# EAGLE design SLIM-MO-64 (EAGLE 6.1)
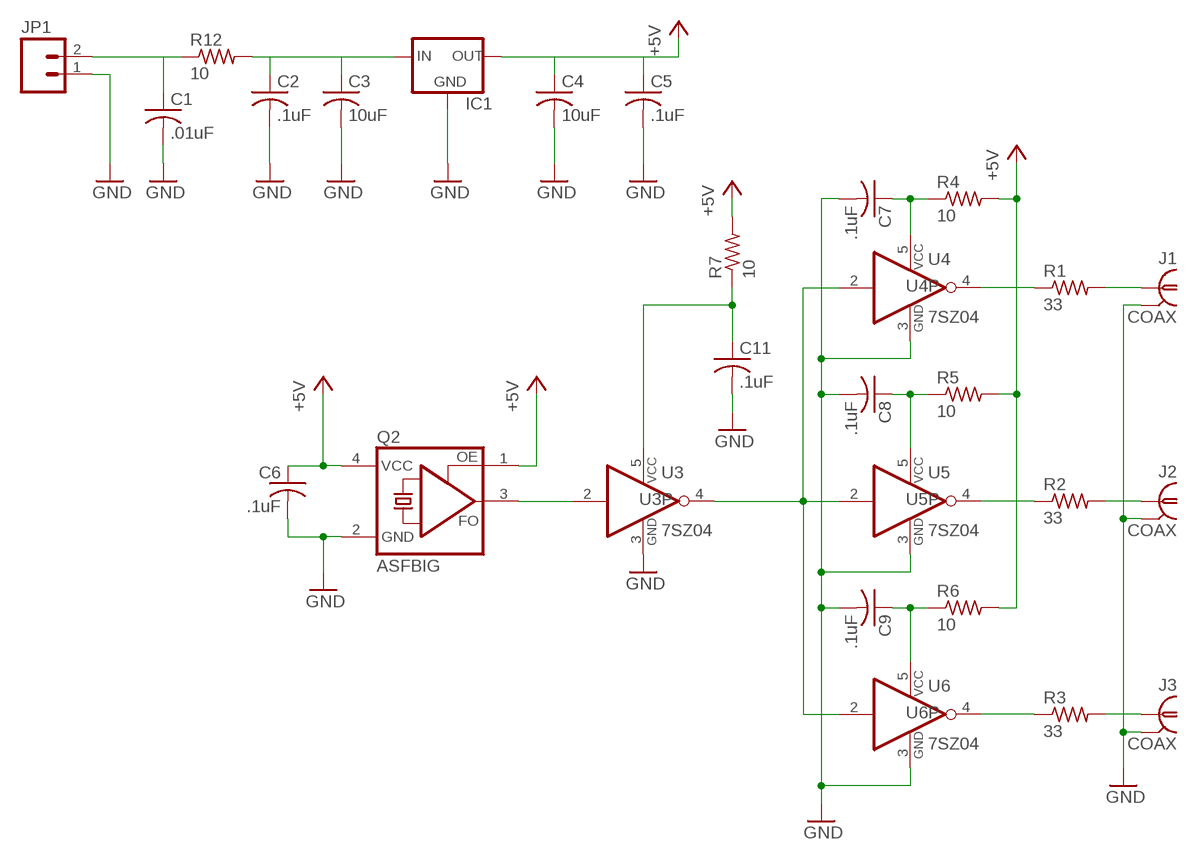
[diagram p0: schematic, sheet 1]

## Parts
C1  .01uF  C-USC0805  [C0805]
C2  .1uF  C-USC0805  [C0805]
C3  10uF  C-USC1206  [C1206]
C4  10uF  C-USC1206  [C1206]
C5  .1uF  C-USC0805  [C0805]
C6  .1uF  C-USC0805  [C0805]
C7  .1uF  C-USC0805  [C0805]
C8  .1uF  C-USC0805  [C0805]
C9  .1uF  C-USC0805  [C0805]
C11  .1uF  C-USC0805  [C0805]
IC1  78MXXLDPAK  [TO252]
J1  COAX  [SLIM_COAX_PAD]
J2  COAX  [SLIM_COAX_PAD]
J3  COAX  [SLIM_COAX_PAD]
JP1  M02POLAR  [MOLEX-1X2]
Q2  ASFBIG  [CTS507]
R1  33  R-US_R0805  [R0805]
R2  33  R-US_R0805  [R0805]
R3  33  R-US_R0805  [R0805]
R4  10  R-US_R0805  [R0805]
R5  10  R-US_R0805  [R0805]
R6  10  R-US_R0805  [R0805]
R7  10  R-US_R0805  [R0805]
R12  10  R-US_R0805  [R0805]
U3  7SZ04  74AHC1G04DBV  [SOT23-5]
U4  7SZ04  74AHC1G04DBV  [SOT23-5]
U5  7SZ04  74AHC1G04DBV  [SOT23-5]
U6  7SZ04  74AHC1G04DBV  [SOT23-5]

## Nets
+5V: C4.1 C5.1 C6.1 IC1.2(OUT) Q2.1(OE) Q2.4(VCC) R4.2 R5.2 R6.2 R7.2
GND: C1.2 C2.2 C3.2 C4.2 C5.2 C6.2 C7.2 C8.2 C9.2 C11.2 IC1.3(GND) J1.P$2(GND) J2.P$2(GND) J3.P$2(GND) JP1.1 Q2.2(GND) U3.3(GND) U4.3(GND) U5.3(GND) U6.3(GND)
N$1: C2.1 C3.1 IC1.1(IN) R12.2
N$2: C1.1 JP1.2 R12.1
N$3: C11.1 R7.1 U3.5(VCC)
N$4: U3.4(O) U4.2(I) U5.2(I) U6.2(I)
N$8: R1.1 U4.4(O)
N$9: R2.1 U5.4(O)
N$10: Q2.3(FO) U3.2(I)
N$11: R3.1 U6.4(O)
N$12: C9.1 R6.1 U6.5(VCC)
N$13: C8.1 R5.1 U5.5(VCC)
N$16: C7.1 R4.1 U4.5(VCC)
N$17: J1.P$1 R1.2
N$18: J2.P$1 R2.2
N$19: J3.P$1 R3.2

## Library data of the parts
C1-C9 C11 = rcl:C-US: CAPACITOR, American symbol
IC1 = SLIM:78MXXL: VOLTAGE REGULATOR
J1-J3 = SLIM:COAX
JP1 = SparkFun:M02: Header 2 Standard 2-pin 0.1" header. Use with straight break away headers (SKU : PRT-00116), right angle break away headers (PRT-00553), swiss pins (PRT-00743), machine pins (PRT-00117), and female headers (PRT-00115). Molex polarized connector foot print use with SKU : PRT-08233 with associated crimp pins and housings.
Q2 = SLIM:ASF*: CRYSTAL CLOCK OSCILLATORS 5.0 Vdc or 3.3 Vdc - LOW PROFILE ULTRA MINIATURE CERAMIC SURFACE MOUNT Source: http://www.abracon.com/Oscillators/asf1-L-L1.pdf
R1-R7 R12 = rcl:R-US_: RESISTOR, American symbol
U3-U6 = 74xx-little-us:74*1G04: INVERTER Gate

## Board

Size 30.48 x 30.48 mm. Coordinates in mm from the lower left corner, seen from the top.
Outline: 0,0 30.48,0 30.48,30.48 0,30.48 0,0
Copper layers (1*16): Top 0.035mm / dielectric 1.5mm / Bottom 0.035mm
Design rules: minimum track width 8mil, minimum drill 20mil, track to track 8mil, track to pad 8mil, pad to pad 8mil, via to via 8mil, smd to smd 8mil, copper to edge 10mil, drill to drill 8mil, minimum pad ring 12mil, minimum via ring 10mil, stop-mask expansion 4mil, vias tented up to drill 25mil, thermal gap 10mil

### Footprints (pad centres in the part's own frame; a part is rotated, then mirrored left to right if it is on the bottom)
C0805 = smd 1.3 x 1.5: 1 -0.95,0; 2 0.95,0
C1206 = smd 1.6 x 1.8: 1 -1.4,0; 2 1.4,0
TO252 = smd 1 x 1.6: 1 -2.28,-4.8; 2 2.28,-4.8 | smd 5.4 x 6.2: 3 0,2.5
SLIM_COAX_PAD = drill 0.508 pad 1.016: P$1 0,0 | smd 1.27 x 0.635 bottom: P$2 0,-1.397
MOLEX-1X2 = drill 1.016 pad 1.88 square: 1 0,0 | drill 1.016 pad 1.88: 2 2.54,0
CTS507 = smd 1.803 x 2.007: 1 -2.54,-2.095; 2 2.54,-2.095; 3 2.54,2.095; 4 -2.54,2.095
R0805 = smd 1.3 x 1.5: 1 -0.95,0; 2 0.95,0
SOT23-5 = smd 0.69 x 0.99: 1 -0.95,-1.29; 2 0,-1.29; 3 0.95,-1.29; 4 0.95,1.3; 5 -0.95,1.3

### Placement (x,y rotation side)
C1  18.54,4.83 0 top
C2  22.35,3.3 90 top
C3  26.42,2.79 0 top
C4  26.42,6.86 0 top
C5  22.35,6.35 270 top
C6  23.62,9.65 180 top
C7  7.87,21.34 180 top
C8  16.51,25.91 90 top
C9  11.43,11.43 270 top
C11  17.27,11.68 270 top
IC1  6.86,4.83 90 top
J1  6.6,23.88 270 top
J2  23.88,23.88 0 top
J3  6.6,11.18 270 top
JP1  11.43,4.83 180 bottom
Q2  25.4,14.73 90 top
R1  9.4,23.88 180 top
R2  21.08,23.88 0 top
R3  8.64,13.21 225 top
R4  7.87,19.3 180 top
R5  14.48,25.91 90 top
R6  13.46,11.43 270 top
R7  19.3,11.68 270 top
R12  16,3.56 270 top
U3  18.54,15.75 90 top
U4  12.27,21.16 45 top
U5  17.6,21.77 315 top
U6  11.76,15.93 135 top

### Tracks (layer width: path | path; a pad name or v marks a point on that pad's centre or on a via)
+5V
  Top 0.61: 2.54,19.3 2.54,25.91 3.56,26.92 14.31,26.92 R5.2 | 2.54,19.3 R4.2 | 2.54,19.3 2.54,10.92 4.32,9.14 8.89,9.14 10.93,7.11 IC1.2
  Top 0.813: R7.2 19.3,7.36 19.05,7.11
  Top 1.016: IC1.2 13.46,7.11 | 13.46,7.11 19.05,7.11 22.35,7.11 | 22.35,7.11 24.89,7.11 | 22.35,7.11 C5.1 | C4.1 25.02,6.98 24.89,7.11 | 24.89,7.11 25.4,7.62 25.4,9.65 | 25.4,9.65 25.4,12.19 | 25.4,9.65 C6.1 | 13.46,7.11 R6.2 | 25.4,12.19 Q2.1 | 25.4,12.19 Q2.4
GND  (via drill 0.51)
  Top 0.61: v29.72,17.53 29.48,17.76 | 0.76,4.83 IC1.3 | U5.3 17.36,20.23 v17.78,19.81 | U4.3 13.85,20.96 v14.22,21.34 | U3.3 19.83,17.29 v19.81,17.27 | U6.3 12,17.72 v11.68,18.03 | Q2.2 27.5,18.1 v27.94,18.54
  Top 0.813: 11.43,9.91 C9.2 | v10.92,9.4 11.43,9.91 | 11.43,9.91 v11.94,9.4 | 17.27,10.16 C11.2 | v16.76,9.65 17.27,10.16 | 17.27,10.16 v17.78,9.65 | C7.2 6.35,21.34 v5.84,21.84 | v5.84,20.83 6.1,21.08 | C8.2 16.51,27.43 | 16.51,27.43 v17.02,27.94 | 16.51,27.43 v16,27.94 | C6.2 22.1,9.65 | 22.1,9.65 v21.59,10.16 | 22.1,9.65 v21.59,9.14 | C4.2 27.82,7.74 | 27.82,7.74 27.94,7.62 v28.45,8.13 | 27.82,7.74 v27.43,8.13 | C3.2 27.82,3.43 v28.45,4.06 | v27.43,4.06 27.69,3.81 | v27.94,18.54 27.94,17.78
  Top 1.016: C1.2 22.1,4.83 | 22.1,4.83 v23.88,4.83 | 22.1,4.83 C5.2 | 22.1,4.83 C2.2 | v0.76,29.72 v20.57,29.72 v29.72,29.72 v29.72,17.53 v29.72,9.14 v29.72,6.35 v29.72,0.76 v0.76,0.76 0.76,4.83 v0.76,29.72
  Top 1.778: 6.86,4.83 JP1.1
  other vias: 3.81,29.72 6.6,29.72 26.67,29.72 12.19,29.72 9.4,29.72 14.99,29.72 17.78,29.72 23.62,29.72 0.76,3.56 0.76,6.35 0.76,26.42 0.76,11.94 0.76,9.14 0.76,14.73 0.76,17.53 0.76,20.32 0.76,23.37 29.72,3.56 29.72,26.42 29.72,11.94 29.72,14.73 29.72,20.32 29.72,23.37 3.81,0.76 6.6,0.76 26.67,0.76 12.19,0.76 9.4,0.76 14.99,0.76 17.78,0.76 20.57,0.76 23.62,0.76 6.6,2.79 6.6,6.86 4.06,6.86 4.06,2.79 5.33,4.83 2.54,4.83 8.89,4.83 20.83,4.83 26.92,18.54
  pour Bottom (isolate 0.254): 0,30.48 30.48,30.48 30.48,0 0,0
N$1
  Top 1.016: IC1.1 16.26,2.55 | 16.26,2.55 22.35,2.55 | 22.35,2.55 24.77,2.55 C3.1 | 22.35,2.55 C2.1 | 16.26,2.55 R12.2
N$2
  Top 1.016: JP1.2 16,4.83 | 16,4.83 C1.1 | 16,4.83 R12.1
N$3
  Top 0.61: U3.5 17.24,12.66 C11.1
  Top 1.016: C11.1 R7.1
N$4
  Top 0.61: 14.68,18.74 16.72,16.7 U3.4 | 14.68,18.74 U4.2 | U6.2 14.57,18.74 14.68,18.74 | 14.68,18.74 16.69,20.75 U5.2
N$8
  Top 0.61: R1.1 10.64,24.13 U4.4
N$9
  Top 0.61: U5.4 20.13,22.96 R2.1
N$10
  Top 0.61: U3.2 21.78,15.75 Q2.3
N$11
  Top 0.61: U6.4 9.31,14.82 R3.1
N$12
  Top 0.61: U6.5 11.51,12.46 C9.1
  Top 1.016: C9.1 R6.1
N$13
  Top 0.61: U5.5 17.85,23.62 C8.1
  Top 1.016: R5.1 C8.1
N$16
  Top 0.61: U4.5 8.82,21.4 C7.1
  Top 1.016: R4.1 C7.1
N$17
  Top 1.422: J1.P$1 R1.2
N$18
  Top 1.422: R2.2 J2.P$1
N$19
  Top 1.422: J3.P$1 R3.2

### Text on the board
Top: PWB-MOB | REV-0E
_tsilk: PWB-MOB | REV-0E | J1 | 33 | 33 | 10 | .1uF | J2 | .1uF | U4 | U5 | 10 | U3 | Q1 | U6 | 33 | 10 | .1uF | 10 | .1uF | J3 | .1uF | IC1 | .1uF | .01uF | 10uF | 10 | .1uF | 10uF
_bsilk: J2 | J1 | PWB-MOB | REV-0E | J3 | GND | +10v